# EAGLE schematic PIC32_JTAG (EAGLE 7.6.0)
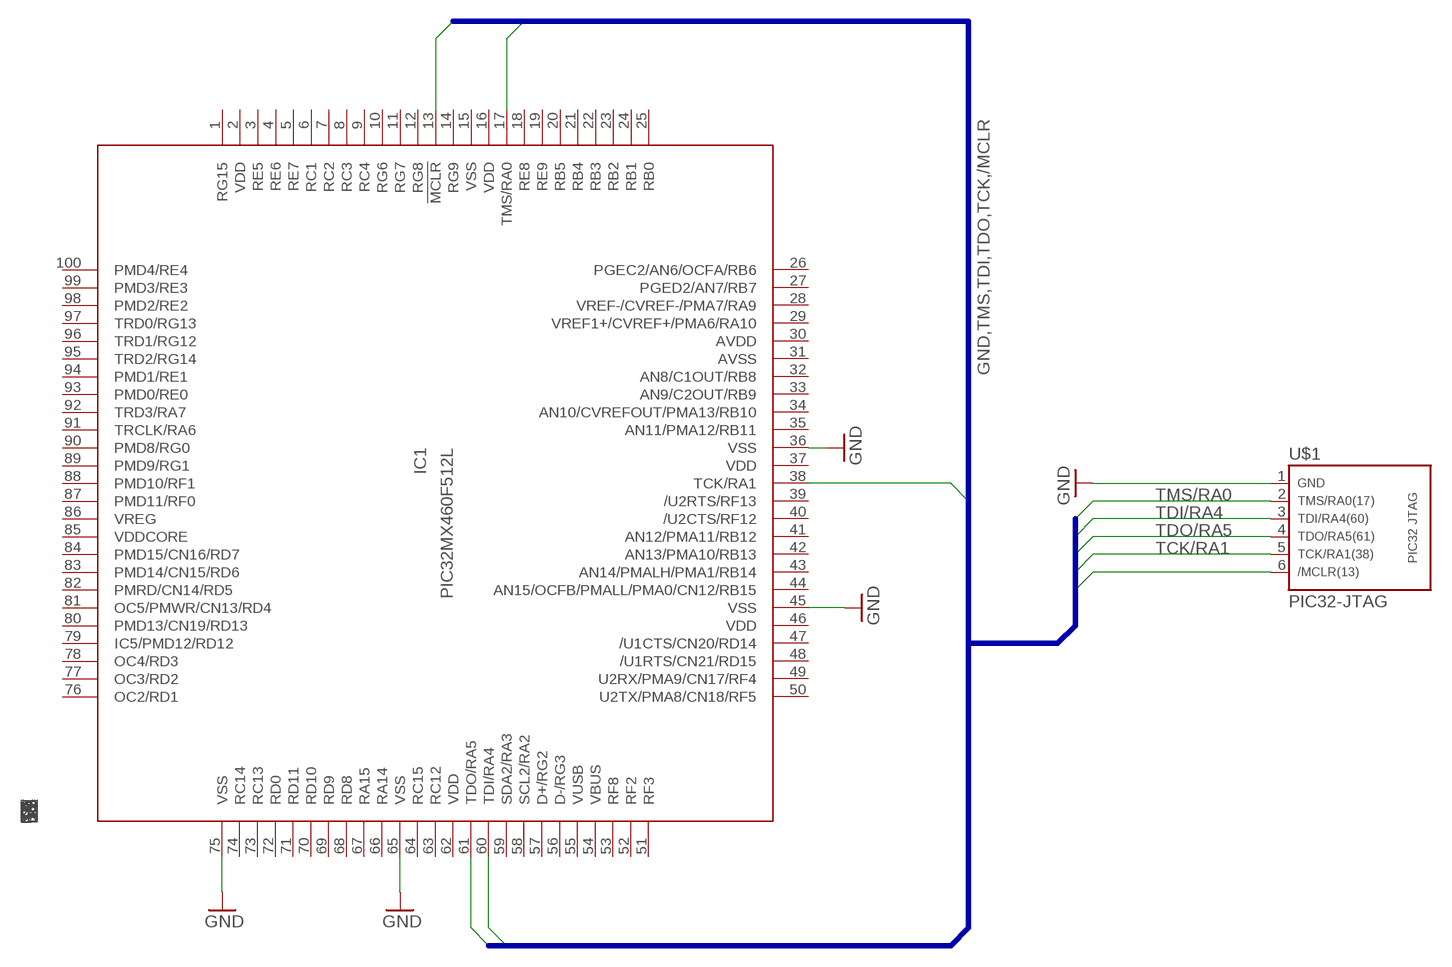
[diagram p0: schematic, sheet 1]

## Parts
IC1  PIC32MX460F512L  [TQFP100]
U$1  PIC32-JTAG  [PIC32-JTAG]

## Nets
/MCLR: IC1.13(!MCLR) U$1.6(/MCLR)
GND: IC1.36(VSS) IC1.45(VSS) IC1.65(VSS) IC1.75(VSS) U$1.1(GND)
TCK/RA1: IC1.38(TCK/RA1) U$1.5(TCK)
TDI/RA4: IC1.60(TDI/RA4) U$1.3(TDI)
TDO/RA5: IC1.61(TDO/RA5) U$1.4(TDO)
TMS/RA0: IC1.17(TMS/RA0) U$1.2(TMS)
Unconnected: IC1.1(RG15) IC1.3(RE5) IC1.4(RE6) IC1.5(RE7) IC1.6(RC1) IC1.7(RC2) IC1.8(RC3) IC1.9(RC4) IC1.10(RG6) IC1.11(RG7) IC1.12(RG8) IC1.14(RG9) IC1.18(RE8) IC1.19(RE9) IC1.20(RB5) IC1.21(RB4) IC1.22(RB3) IC1.23(RB2) IC1.24(RB1) IC1.25(RB0) IC1.26(PGEC2/AN6/OCFA/RB6) IC1.27(PGED2/AN7/RB7) IC1.28(VREF-/CVREF-/PMA7/RA9) IC1.29(VREF1+/CVREF+/PMA6/RA10) IC1.32(AN8/C1OUT/RB8) IC1.33(AN9/C2OUT/RB9) IC1.34(AN10/CVREFOUT/PMA13/RB10) IC1.35(AN11/PMA12/RB11) IC1.39(/U2RTS/RF13) IC1.40(/U2CTS/RF12) IC1.41(AN12/PMA11/RB12) IC1.42(AN13/PMA10/RB13) IC1.43(AN14/PMALH/PMA1/RB14) IC1.44(AN15/OCFB/PMALL/PMA0/CN12/RB15) IC1.47(/U1CTS/CN20/RD14) IC1.48(/U1RTS/CN21/RD15) IC1.49(U2RX/PMA9/CN17/RF4) IC1.50(U2TX/PMA8/CN18/RF5) IC1.51(RF3) IC1.52(RF2) IC1.53(RF8) IC1.54(VBUS) IC1.55(VUSB) IC1.56(D-/RG3) IC1.57(D+/RG2) IC1.58(SCL2/RA2) IC1.59(SDA2/RA3) IC1.63(RC12) IC1.64(RC15) IC1.66(RA14) IC1.67(RA15) IC1.68(RD8) IC1.69(RD9) IC1.70(RD10) IC1.71(RD11) IC1.72(RD0) IC1.73(RC13) IC1.74(RC14) IC1.76(OC2/RD1) IC1.77(OC3/RD2) IC1.78(OC4/RD3) IC1.79(IC5/PMD12/RD12) IC1.80(PMD13/CN19/RD13) IC1.81(OC5/PMWR/CN13/RD4) IC1.82(PMRD/CN14/RD5) IC1.83(PMD14/CN15/RD6) IC1.84(PMD15/CN16/RD7) IC1.86(VREG) IC1.87(PMD11/RF0) IC1.88(PMD10/RF1) IC1.89(PMD9/RG1) IC1.90(PMD8/RG0) IC1.91(TRCLK/RA6) IC1.92(TRD3/RA7) IC1.93(PMD0/RE0) IC1.94(PMD1/RE1) IC1.95(TRD2/RG14) IC1.96(TRD1/RG12) IC1.97(TRD0/RG13) IC1.98(PMD2/RE2) IC1.99(PMD3/RE3) IC1.100(PMD4/RE4)

## Buses
GND,TMS,TDI,TDO,TCK,/MCLR

## Power pins joined to a net without a drawn wire
AVDD: IC1.30(AVDD)
AVSS: IC1.31(AVSS)
VDD: IC1.2(VDD) IC1.16(VDD) IC1.37(VDD) IC1.46(VDD) IC1.62(VDD)
VDDCORE: IC1.85(VDDCORE)
VSS: IC1.15(VSS)

## Library data of the parts
IC1 = mcu:PIC32MX460F512L: PIC32MX460F512L edit this description Auto generated by make-symbol-device-package-bsdl.ulp Rev. 25 Source: PIC32MX460F512L.bsdl
U$1 = pinconn:PIC32-JTAG

## Net classes
0 default: width 0.254 mm